# Altium schematic sheet proyecto final.SchDoc
size A2
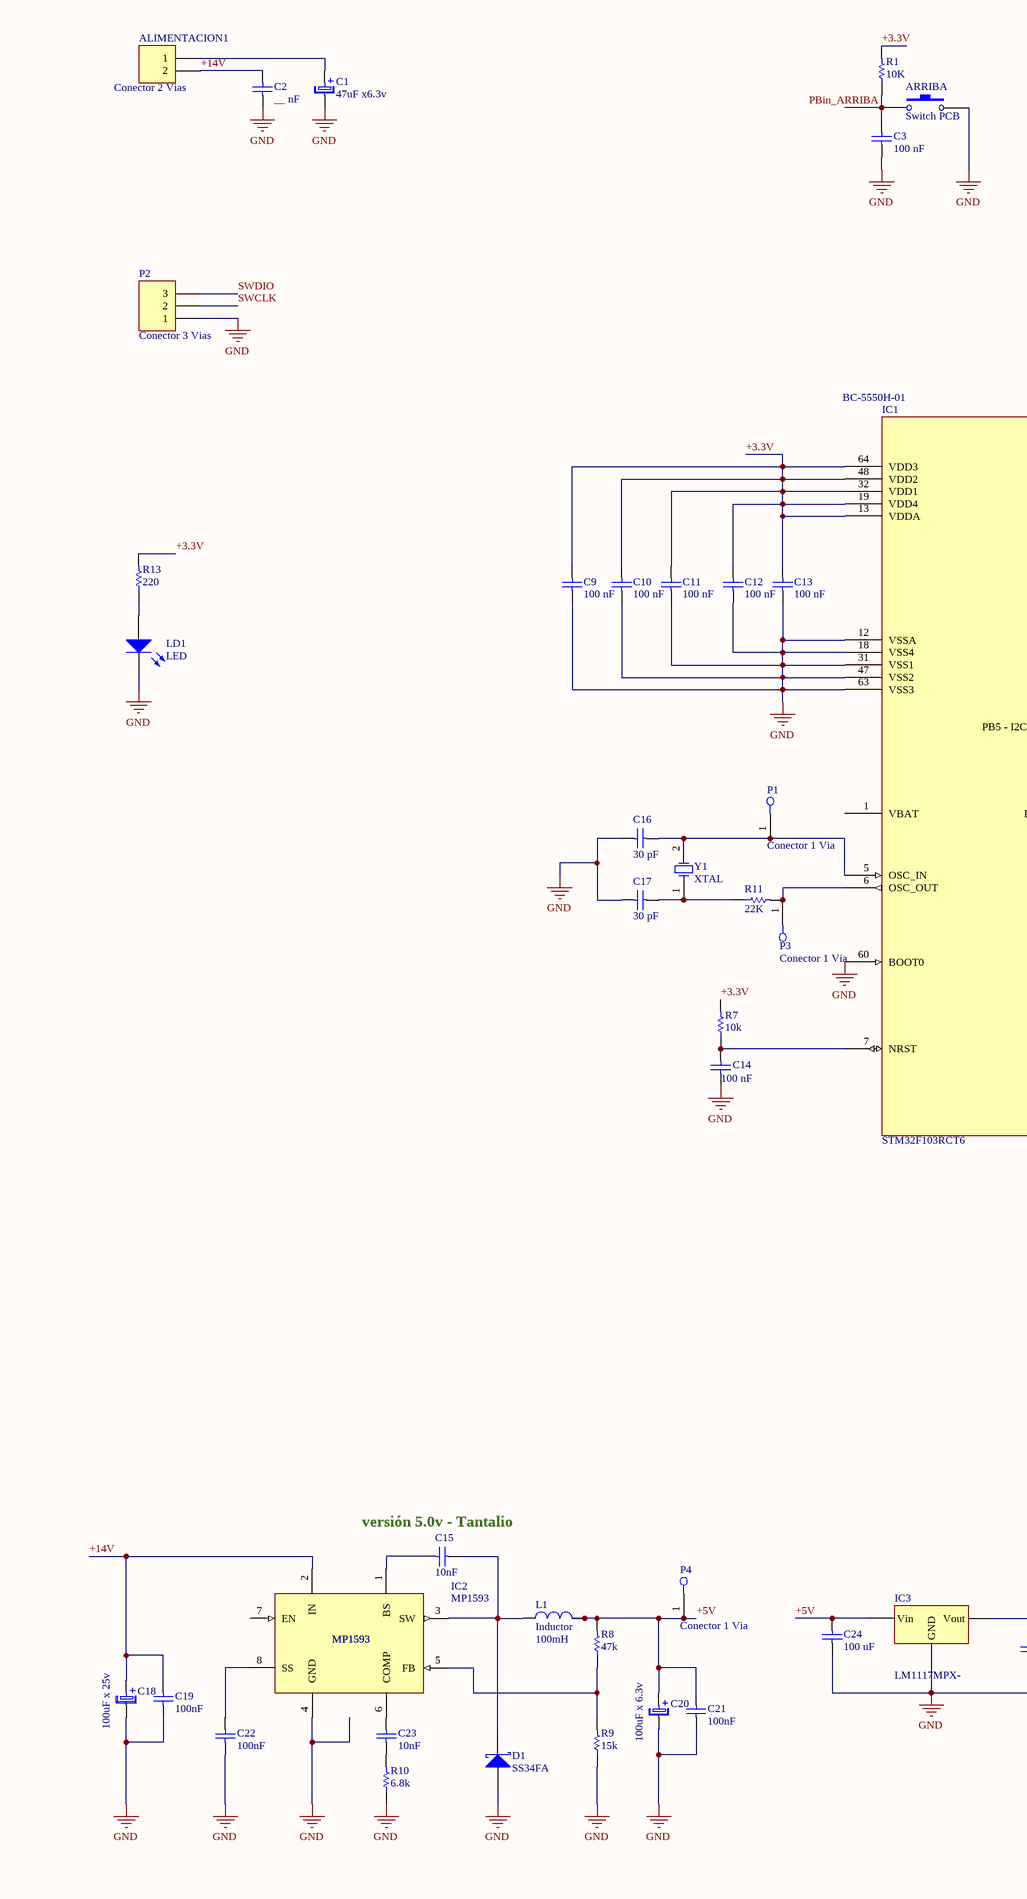
[diagram p0: proyecto final.SchDoc, left]
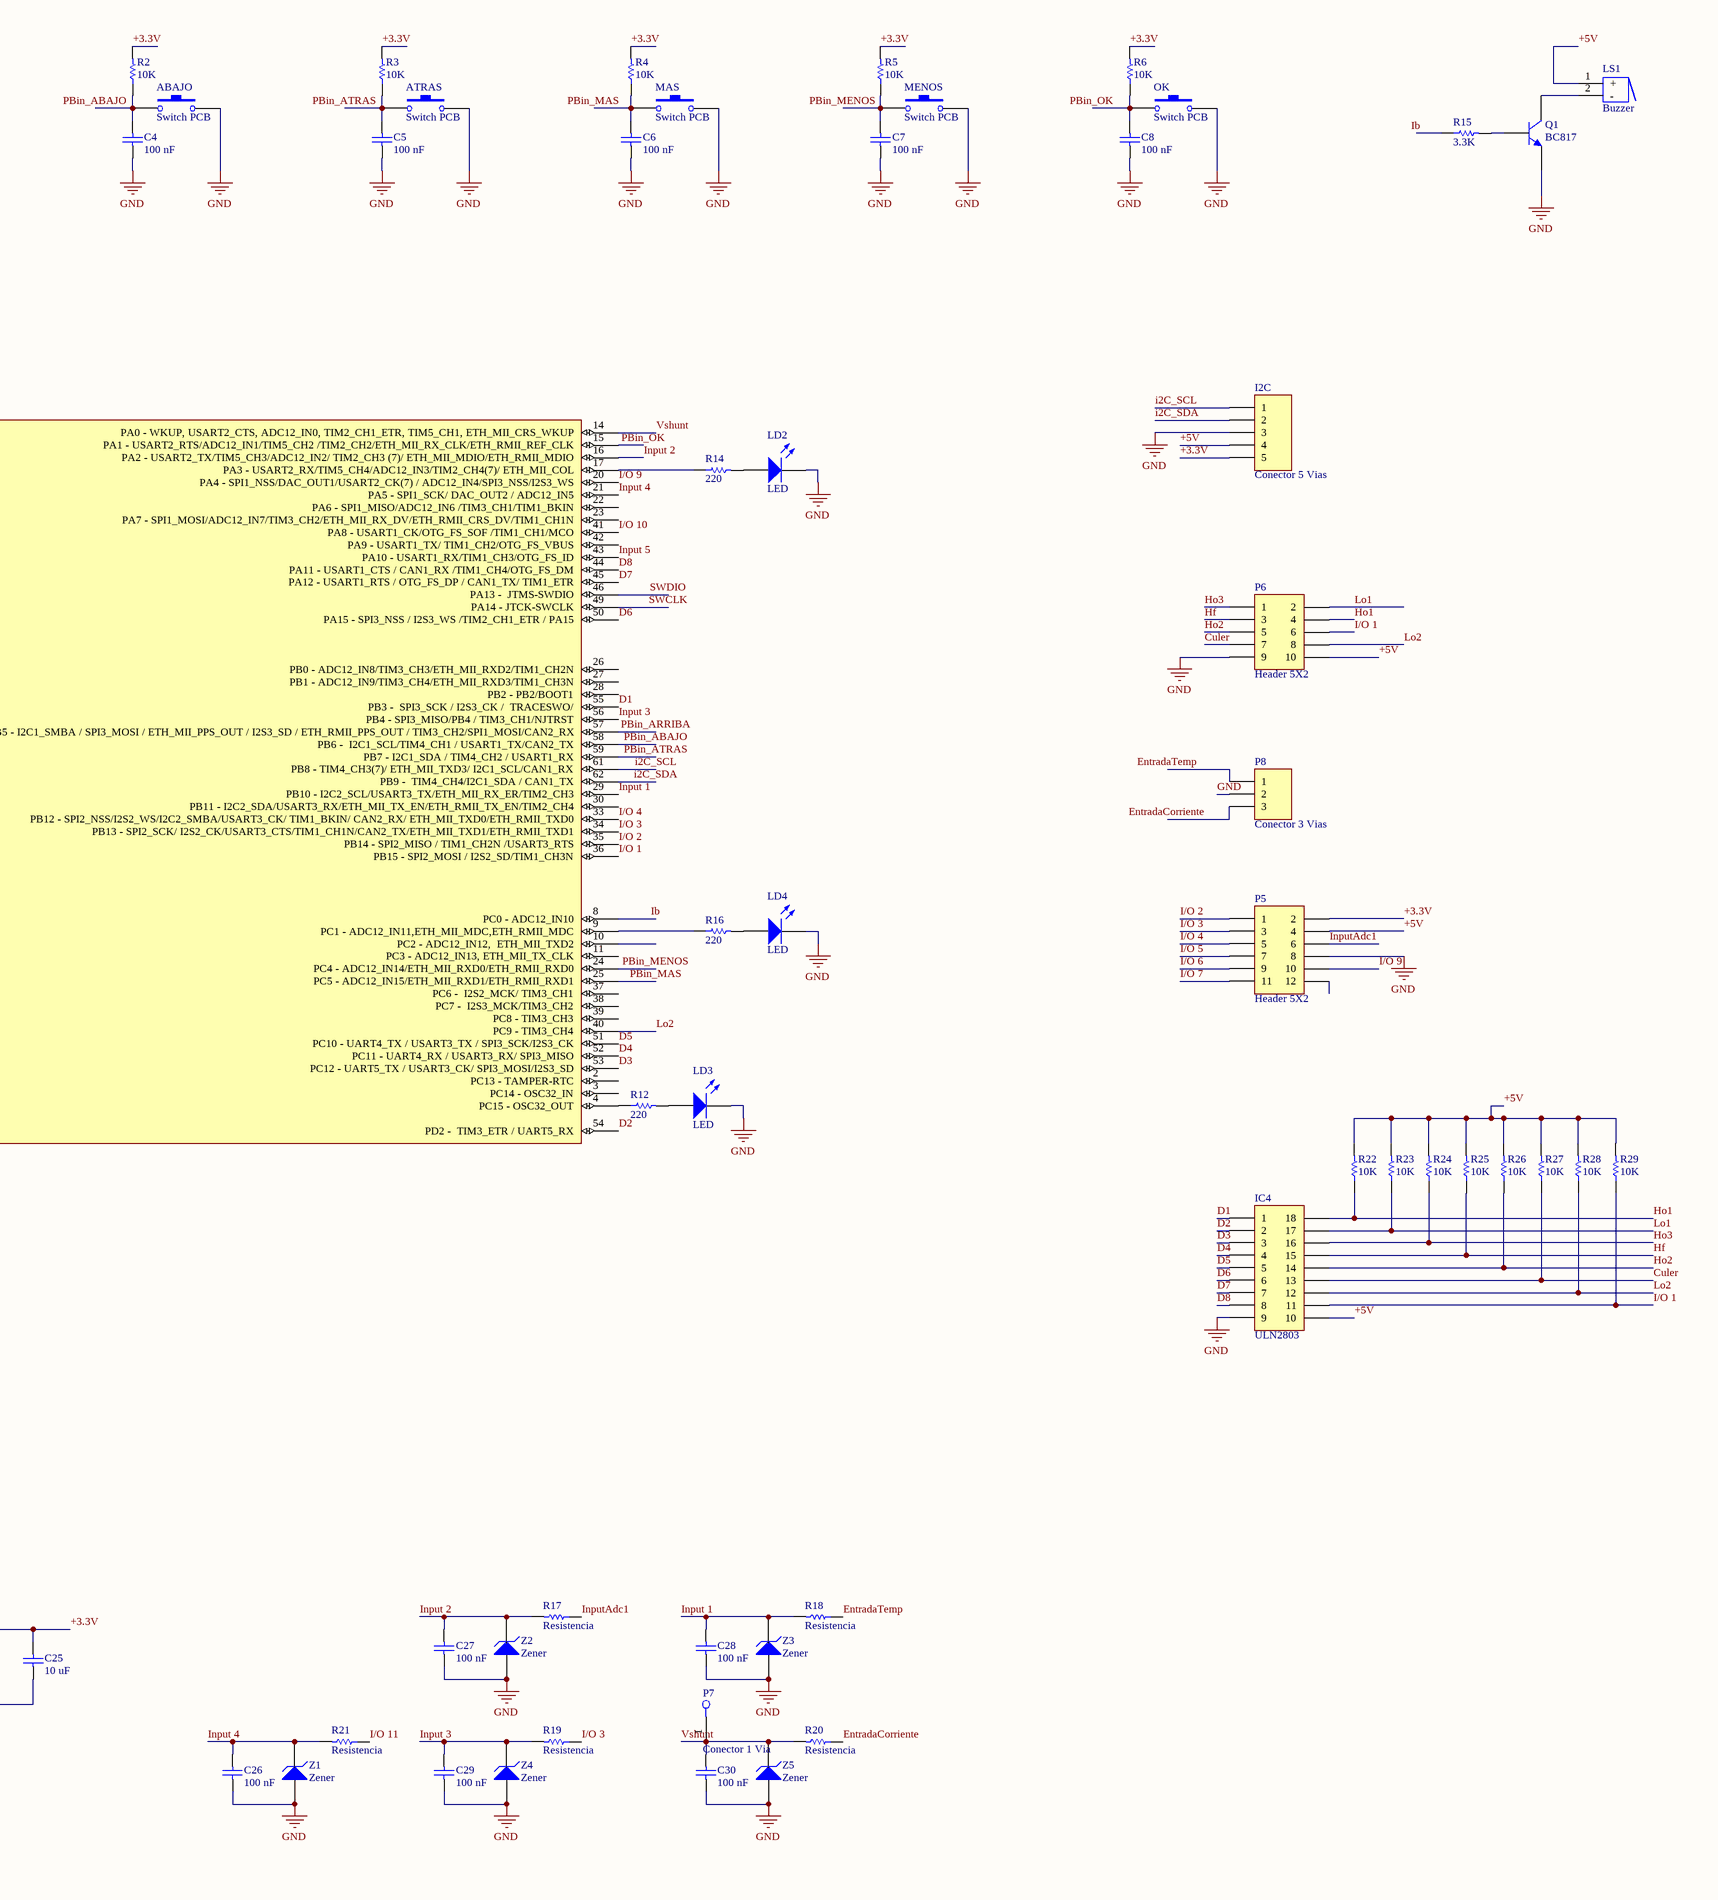
[diagram p1: proyecto final.SchDoc, right]

## Parts
ABAJO  Switch PCB  [TAC SWITCH 6X6 (5MM)]
ALIMENTACION1  Conector 2 Vias  [CON 2]
ARRIBA  Switch PCB  [TAC SWITCH 6X6 (5MM)]
ATRAS  Switch PCB  [TAC SWITCH 6X6 (5MM)]
C1  47uF x6.3v  [CAP Pitch 80 - 5x11]
C2  __ nF  [C-0805]
C3  100 nF  [C-0805]
C4  100 nF  [C-0805]
C5  100 nF  [C-0805]
C6  100 nF  [C-0805]
C7  100 nF  [C-0805]
C8  100 nF  [C-0805]
C9  100 nF  [C-0805]
C10  100 nF  [C-0805]
C11  100 nF  [C-0805]
C12  100 nF  [C-0805]
C13  100 nF  [C-0805]
C14  100 nF  [C-0805]
C15  10nF  [C-0805]
C16  30 pF  [C-0805]
C17  30 pF  [C-0805]
C18  100uF x 25v  [C-CASE-B]
C19  100nF  [C-0805]
C20  100uF x 6.3v  [C-CASE-B]
C21  100nF  [C-0805]
C22  100nF  [C-0805]
C23  10nF  [C-0805]
C24  100 uF  [C-0805]
C25  10 uF  [C-0805]
C26  100 nF  [C-0805]
C27  100 nF  [C-0805]
C28  100 nF  [C-0805]
C29  100 nF  [C-0805]
C30  100 nF  [C-0805]
D1  SS34FA  [SOD-123]
I2C  Conector 5 Vias  [HEADER-V-5]
IC1  STM32F103RCT6  Supplier Part Number 1: BC-5550H-01  [LQFP-64]
IC2  MP1593  [SOIC-8E]
IC3  LM1117MPX-  [SOT-223 TERMICO]
IC4  ULN2803  [SOIC-18]
L1  Inductor  value 100mH  [INDUCTOR CDRH6D28NP-100NC]
LD1  LED  [LD-0805-AZUL]
LD2  LED  [LD-0805-AZUL]
LD3  LED  [LD-0805-AZUL]
LD4  LED  [LD-0805-AZUL]
LS1  Buzzer  [BUZZER]
MAS  Switch PCB  [TAC SWITCH 6X6 (5MM)]
MENOS  Switch PCB  [TAC SWITCH 6X6 (5MM)]
OK  Switch PCB  [TAC SWITCH 6X6 (5MM)]
P1  Conector 1 Via  [PAD 1.5x2.5mm]
P2  Conector 3 Vias  [HEADER-V-3]
P3  Conector 1 Via  [PAD 1.5x2.5mm]
P4  Conector 1 Via  [PAD 1.5x2.5mm]
P5  Header 5X2  [HEADER 6x2]
P6  Header 5X2  [HEADER 5x2]
P7  Conector 1 Via  [PAD 1.5x2.5mm]
P8  Conector 3 Vias  [HEADER-V-3]
Q1  BC817  [SOT-23]
R1  10K  [R-0805]
R2  10K  [R-0805]
R3  10K  [R-0805]
R4  10K  [R-0805]
R5  10K  [R-0805]
R6  10K  [R-0805]
R7  10k  [R-0805]
R8  47k  [R-0805]
R9  15k  [R-0805]
R10  6.8k  [R-0805]
R11  22K  [R-0805]
R12  220  [R-0805]
R13  220  [R-0805]
R14  220  [R-0805]
R15  3.3K  [R-0805]
R16  220  [R-0805]
R17  Resistencia  [R-0805]
R18  Resistencia  [R-0805]
R19  Resistencia  [R-0805]
R20  Resistencia  [R-0805]
R21  Resistencia  [R-0805]
R22  10K  [R-0805]
R23  10K  [R-0805]
R24  10K  [R-0805]
R25  10K  [R-0805]
R26  10K  [R-0805]
R27  10K  [R-0805]
R28  10K  [R-0805]
R29  10K  [R-0805]
Y1  XTAL  [CRISTAL COMBINADO]
Z1  Zener  [SOT-23]
Z2  Zener  [SOT-23]
Z3  Zener  [SOT-23]
Z4  Zener  [SOT-23]
Z5  Zener  [SOT-23]

## Nets
GND: ABAJO.2 ARRIBA.2 ATRAS.2 C1.2 C2.1 C3.1 C4.1 C5.1 C6.1 C7.1 C8.1 C9.1 C10.1 C11.1 C12.1 C13.1 C14.1 C16.2 C17.2 C18.2 C19.1 C20.2 C21.1 C22.1 C24.2 C25.2 C26.1 C27.1 C28.1 C29.1 C30.1 D1.1(A) I2C.3 IC1.12(VSSA) IC1.18(VSS4) IC1.31(VSS1) IC1.47(VSS2) IC1.60(BOOT0) IC1.63(VSS3) IC2.4(GND) IC3.1(GND) IC4.9 LD1.2(K) LD2.2(K) LD3.2(K) LD4.2(K) MAS.2 MENOS.2 OK.2 P2.1 P5.8 P6.9 P8.2 Q1.2(E) R9.1 R10.1 Z1.1(A) Z2.1(A) Z3.1(A) Z4.1(A) Z5.1(A)
+3.3V: C9.2 C10.2 C11.2 C12.2 C13.2 C25.1 I2C.5 IC1.13(VDDA) IC1.19(VDD4) IC1.32(VDD1) IC1.48(VDD2) IC1.64(VDD3) IC3.2(Vout) P5.2 R1.2 R2.2 R3.2 R4.2 R5.2 R6.2 R7.2 R13.2
+5V: C20.1 C21.2 C24.1 I2C.4 IC3.3(Vin) IC4.10 L1.2 LS1.1(+) P4.1 P5.4 P6.10 R8.2 R22.2 R23.2 R24.2 R25.2 R26.2 R27.2 R28.2 R29.2
+14V: ALIMENTACION1.2 C2.2 C18.1 C19.2 IC2.2(IN)
Culer: IC4.13 P6.7 R27.1
D1: IC1.55(PB3_-__SPI3_SCK_/_I2S3_CK_/__TRACESWO/) IC4.1
D2: IC1.54(PD2_-__TIM3_ETR_/_UART5_RX) IC4.2
D3: IC1.53(PC12_-_UART5_TX_/_USART3_CK/_SPI3_MOSI/I2S3_SD) IC4.3
D4: IC1.52(PC11_-_UART4_RX_/_USART3_RX/_SPI3_MISO) IC4.4
D5: IC1.51(PC10_-_UART4_TX_/_USART3_TX_/_SPI3_SCK/I2S3_CK) IC4.5
D6: IC1.50(PA15_-_SPI3_NSS_/_I2S3_WS_/TIM2_CH1_ETR_/_PA15) IC4.6
D7: IC1.45(PA12_-_USART1_RTS_/_OTG_FS_DP_/_CAN1_TX/_TIM1_ETR) IC4.7
D8: IC1.44(PA11_-_USART1_CTS_/_CAN1_RX_/TIM1_CH4/OTG_FS_DM) IC4.8
EntradaCorriente: P8.3 R20.1
EntradaTemp: P8.1 R18.1
Hf: IC4.15 P6.3 R25.1
Ho1: IC4.18 P6.4 R22.1
Ho2: IC4.14 P6.5 R26.1
Ho3: IC4.16 P6.1 R24.1
i2C_SCL: I2C.1 IC1.61(PB8_-_TIM4_CH3(7)/_ETH_MII_TXD3/_I2C1_SCL/CAN1_RX)
i2C_SDA: I2C.2 IC1.62(PB9_-__TIM4_CH4/I2C1_SDA_/_CAN1_TX)
I/O 1: IC1.36(PB15_-_SPI2_MOSI_/_I2S2_SD/TIM1_CH3N) IC4.11 P6.6 R29.1
I/O 2: IC1.35(PB14_-_SPI2_MISO_/_TIM1_CH2N_/USART3_RTS) P5.1
I/O 3: IC1.34(PB13_-_SPI2_SCK/_I2S2_CK/USART3_CTS/TIM1_CH1N/CAN2_TX/ETH_MII_TXD1/ETH_RMII_TXD1) P5.3 R19.1
I/O 4: IC1.33(PB12_-_SPI2_NSS/I2S2_WS/I2C2_SMBA/USART3_CK/_TIM1_BKIN/_CAN2_RX/_ETH_MII_TXD0/ETH_RMII_TXD0) P5.5
I/O 5: P5.7
I/O 6: P5.9
I/O 7: P5.11
I/O 9: IC1.20(PA4_-_SPI1_NSS/DAC_OUT1/USART2_CK(7)_/_ADC12_IN4/SPI3_NSS/I2S3_WS) P5.10
I/O 10: IC1.41(PA8_-_USART1_CK/OTG_FS_SOF_/TIM1_CH1/MCO)
I/O 11: R21.1
Ib: IC1.8(PC0_-_ADC12_IN10) R15.1
Input 1: C28.2 IC1.29(PB10_-_I2C2_SCL/USART3_TX/ETH_MII_RX_ER/TIM2_CH3) R18.2 Z3.3(K)
Input 2: C27.2 IC1.16(PA2_-_USART2_TX/TIM5_CH3/ADC12_IN2/_TIM2_CH3_(7)/_ETH_MII_MDIO/ETH_RMII_MDIO) R17.2 Z2.3(K)
Input 3: C29.2 IC1.56(PB4_-_SPI3_MISO/PB4_/_TIM3_CH1/NJTRST) R19.2 Z4.3(K)
Input 4: C26.2 IC1.21(PA5_-_SPI1_SCK/_DAC_OUT2_/_ADC12_IN5) R21.2 Z1.3(K)
Input 5: IC1.43(PA10_-_USART1_RX/TIM1_CH3/OTG_FS_ID)
InputAdc1: P5.6 R17.1
Lo1: IC4.17 P6.2 R23.1
Lo2: IC1.40(PC9_-_TIM3_CH4) IC4.12 P6.8 R28.1
PBin_ABAJO: ABAJO.1 C4.2 IC1.58(PB6_-__I2C1_SCL/TIM4_CH1_/_USART1_TX/CAN2_TX) R2.1
PBin_ARRIBA: ARRIBA.1 C3.2 IC1.57(PB5_-_I2C1_SMBA_/_SPI3_MOSI_/_ETH_MII_PPS_OUT_/_I2S3_SD_/_ETH_RMII_PPS_OUT_/_TIM3_CH2/SPI1_MOSI/CAN2_RX) R1.1
PBin_ATRAS: ATRAS.1 C5.2 IC1.59(PB7_-_I2C1_SDA_/_TIM4_CH2_/_USART1_RX) R3.1
PBin_MAS: C6.2 IC1.25(PC5_-_ADC12_IN15/ETH_MII_RXD1/ETH_RMII_RXD1) MAS.1 R4.1
PBin_MENOS: C7.2 IC1.24(PC4_-_ADC12_IN14/ETH_MII_RXD0/ETH_RMII_RXD0) MENOS.1 R5.1
PBin_OK: C8.2 IC1.15(PA1_-_USART2_RTS/ADC12_IN1/TIM5_CH2_/TIM2_CH2/ETH_MII_RX_CLK/ETH_RMII_REF_CLK) OK.1 R6.1
SWCLK: IC1.49(PA14_-_JTCK-SWCLK) P2.2
SWDIO: IC1.46(PA13_-__JTMS-SWDIO) P2.3
Vshunt: C30.2 IC1.14(PA0_-_WKUP,_USART2_CTS,_ADC12_IN0,_TIM2_CH1_ETR,_TIM5_CH1,_ETH_MII_CRS_WKUP) P7.1 R20.2 Z5.3(K)
NetALIMENTACION1_1: ALIMENTACION1.1 C1.1
NetC14_2: C14.2 IC1.7(NRST) R7.1
NetC15_1: C15.1 IC2.1(BS)
NetC15_2: C15.2 D1.2(K) IC2.3(SW) L1.1
NetC16_1: C16.1 IC1.5(OSC_IN) P1.1 Y1.2(OSC2)
NetC17_1: C17.1 R11.1 Y1.1(OSC1)
NetC22_2: C22.2 IC2.8(SS)
NetC23_1: C23.1 R10.2
NetC23_2: C23.2 IC2.6(COMP)
NetIC1_4: IC1.4(PC15_-_OSC32_OUT) R12.1
NetIC1_6: IC1.6(OSC_OUT) P3.1 R11.2
NetIC1_9: IC1.9(PC1_-_ADC12_IN11,ETH_MII_MDC,ETH_RMII_MDC) R16.1
NetIC1_17: IC1.17(PA3_-_USART2_RX/TIM5_CH4/ADC12_IN3/TIM2_CH4(7)/_ETH_MII_COL) R14.1
NetIC2_5: IC2.5(FB) R8.1 R9.2
NetLD1_1: LD1.1(A) R13.1
NetLD2_1: LD2.1(A) R14.2
NetLD3_1: LD3.1(A) R12.2
NetLD4_1: LD4.1(A) R16.2
NetLS1_2: LS1.2(-) Q1.3(C)
NetQ1_1: Q1.1(B) R15.2

Not connected (* = marked no-connect by the designer): IC1 1(VBAT) 2(PC13_-_TAMPER-RTC) 3(PC14_-_OSC32_IN) 10(PC2_-_ADC12_IN12,__ETH_MII_TXD2) 11(PC3_-_ADC12_IN13,_ETH_MII_TX_CLK) 22(PA6_-_SPI1_MISO/ADC12_IN6_/TIM3_CH1/TIM1_BKIN) 23(PA7_-_SPI1_MOSI/ADC12_IN7/TIM3_CH2/ETH_MII_RX_DV/ETH_RMII_CRS_DV/TIM1_CH1N) 26(PB0_-_ADC12_IN8/TIM3_CH3/ETH_MII_RXD2/TIM1_CH2N) 27(PB1_-_ADC12_IN9/TIM3_CH4/ETH_MII_RXD3/TIM1_CH3N) 28(PB2_-_PB2/BOOT1) 30(PB11_-_I2C2_SDA/USART3_RX/ETH_MII_TX_EN/ETH_RMII_TX_EN/TIM2_CH4) 37(PC6_-__I2S2_MCK/_TIM3_CH1) 38(PC7_-__I2S3_MCK/TIM3_CH2) 39(PC8_-_TIM3_CH3) 42(PA9_-_USART1_TX/_TIM1_CH2/OTG_FS_VBUS); IC2 7(EN); P5 12; Z1 2(NC); Z2 2(NC); Z3 2(NC); Z4 2(NC); Z5 2(NC)

## Notes on the sheet
- (near C15) versión 5.0v - Tantalio
- Title
- Size:
- Date:
- File:
- A2
- Number:
- Time:
- Revision:
- Sheet
- of

## Library data of the parts
ALIMENTACION1 = Header 2: Header, 2-Pin; LatestRevisionDate: 17-Jul-2002; LatestRevisionNote: Re-released for DXP Platform.; Publisher: Altium Limited
C1 C18 C20 = Capacitor Polarizado: Capacitor Polarizado (Radial); Published: 8-Jun-2000; LatestRevisionDate: 17-Jul-2002; LatestRevisionNote: Re-released for DXP Platform.; PackageReference: RB7.6-15; Publisher: Altium Limited
C2-C17 C19 C21-C30 = Capacitor NP: Capacitor No Polarizado (Axial)
D1 = Diodo Schottky
I2C = Header 5: Header, 5-Pin; LatestRevisionDate: 17-Jul-2002; LatestRevisionNote: Re-released for DXP Platform.; Publisher: Altium Limited
IC1 = STM32F103RCT6: CPU M3 72MHz / 256k Flash / 2 ADC / 2 I2C / 5 USART; Supplier 1: Avnet
IC2 = MP1593: Step-Down Converter 3A, 28V, 385kHz
IC4 = ULN2803: Eigth darlignton array; LatestRevisionDate: 17-Jul-2002; LatestRevisionNote: Re-released for DXP Platform.; Publisher: Altium Limited
L1 = Inductor: Code_IEC: 1005; Published: 8-Jun-2000; LatestRevisionDate: 17-Jul-2002; LatestRevisionNote: Re-released for DXP Platform.; PackageReference: 0402-A; Publisher: Altium Limited; Code_JEITA: 0402
LD1-LD4 = LED: Diodo LED
LS1 = Buzzer: Magnetic Transducer Buzzer; Published: 24-Mar-1999; LatestRevisionDate: 17-Jul-2002; LatestRevisionNote: Re-released for DXP Platform.; PackageReference: PIN2; Publisher: Altium Limited
P1 P3 P4 P7 = Header 1: Header, 1-Pin
P2 P8 = Header 3: Header, 3-Pin; LatestRevisionDate: 17-Jul-2002; LatestRevisionNote: Re-released for DXP Platform.; Publisher: Altium Limited
P5 = Header 6X2: Header, 5-Pin, Dual row; LatestRevisionDate: 17-Jul-2002; LatestRevisionNote: Re-released for DXP Platform.; Publisher: Altium Limited
P6 = Header 5X2: Header, 5-Pin, Dual row; LatestRevisionDate: 17-Jul-2002; LatestRevisionNote: Re-released for DXP Platform.; Publisher: Altium Limited
Q1 = BC817: 45 V, 500 mA NPN general-purpose transistors
R1-R16 R22-R29 = Resistencia
Y1 = XTAL: Crystal Oscillator; Published: 8-Jun-2000; LatestRevisionDate: 17-Jul-2002; LatestRevisionNote: Re-released for DXP Platform.; PackageReference: R38; Publisher: Altium Limited
Z1-Z5 = Diodo Zener SOT-23: Zener Diode SOT-23
ABAJO ARRIBA ATRAS MAS MENOS OK = Switch PCB: Published: 24-Mar-1999; LatestRevisionDate: 17-Jul-2002; LatestRevisionNote: Re-released for DXP Platform.; PackageReference: SPST-2; Publisher: Altium Limited